# Altium schematic sheet Sheet2.SchDoc
size A3
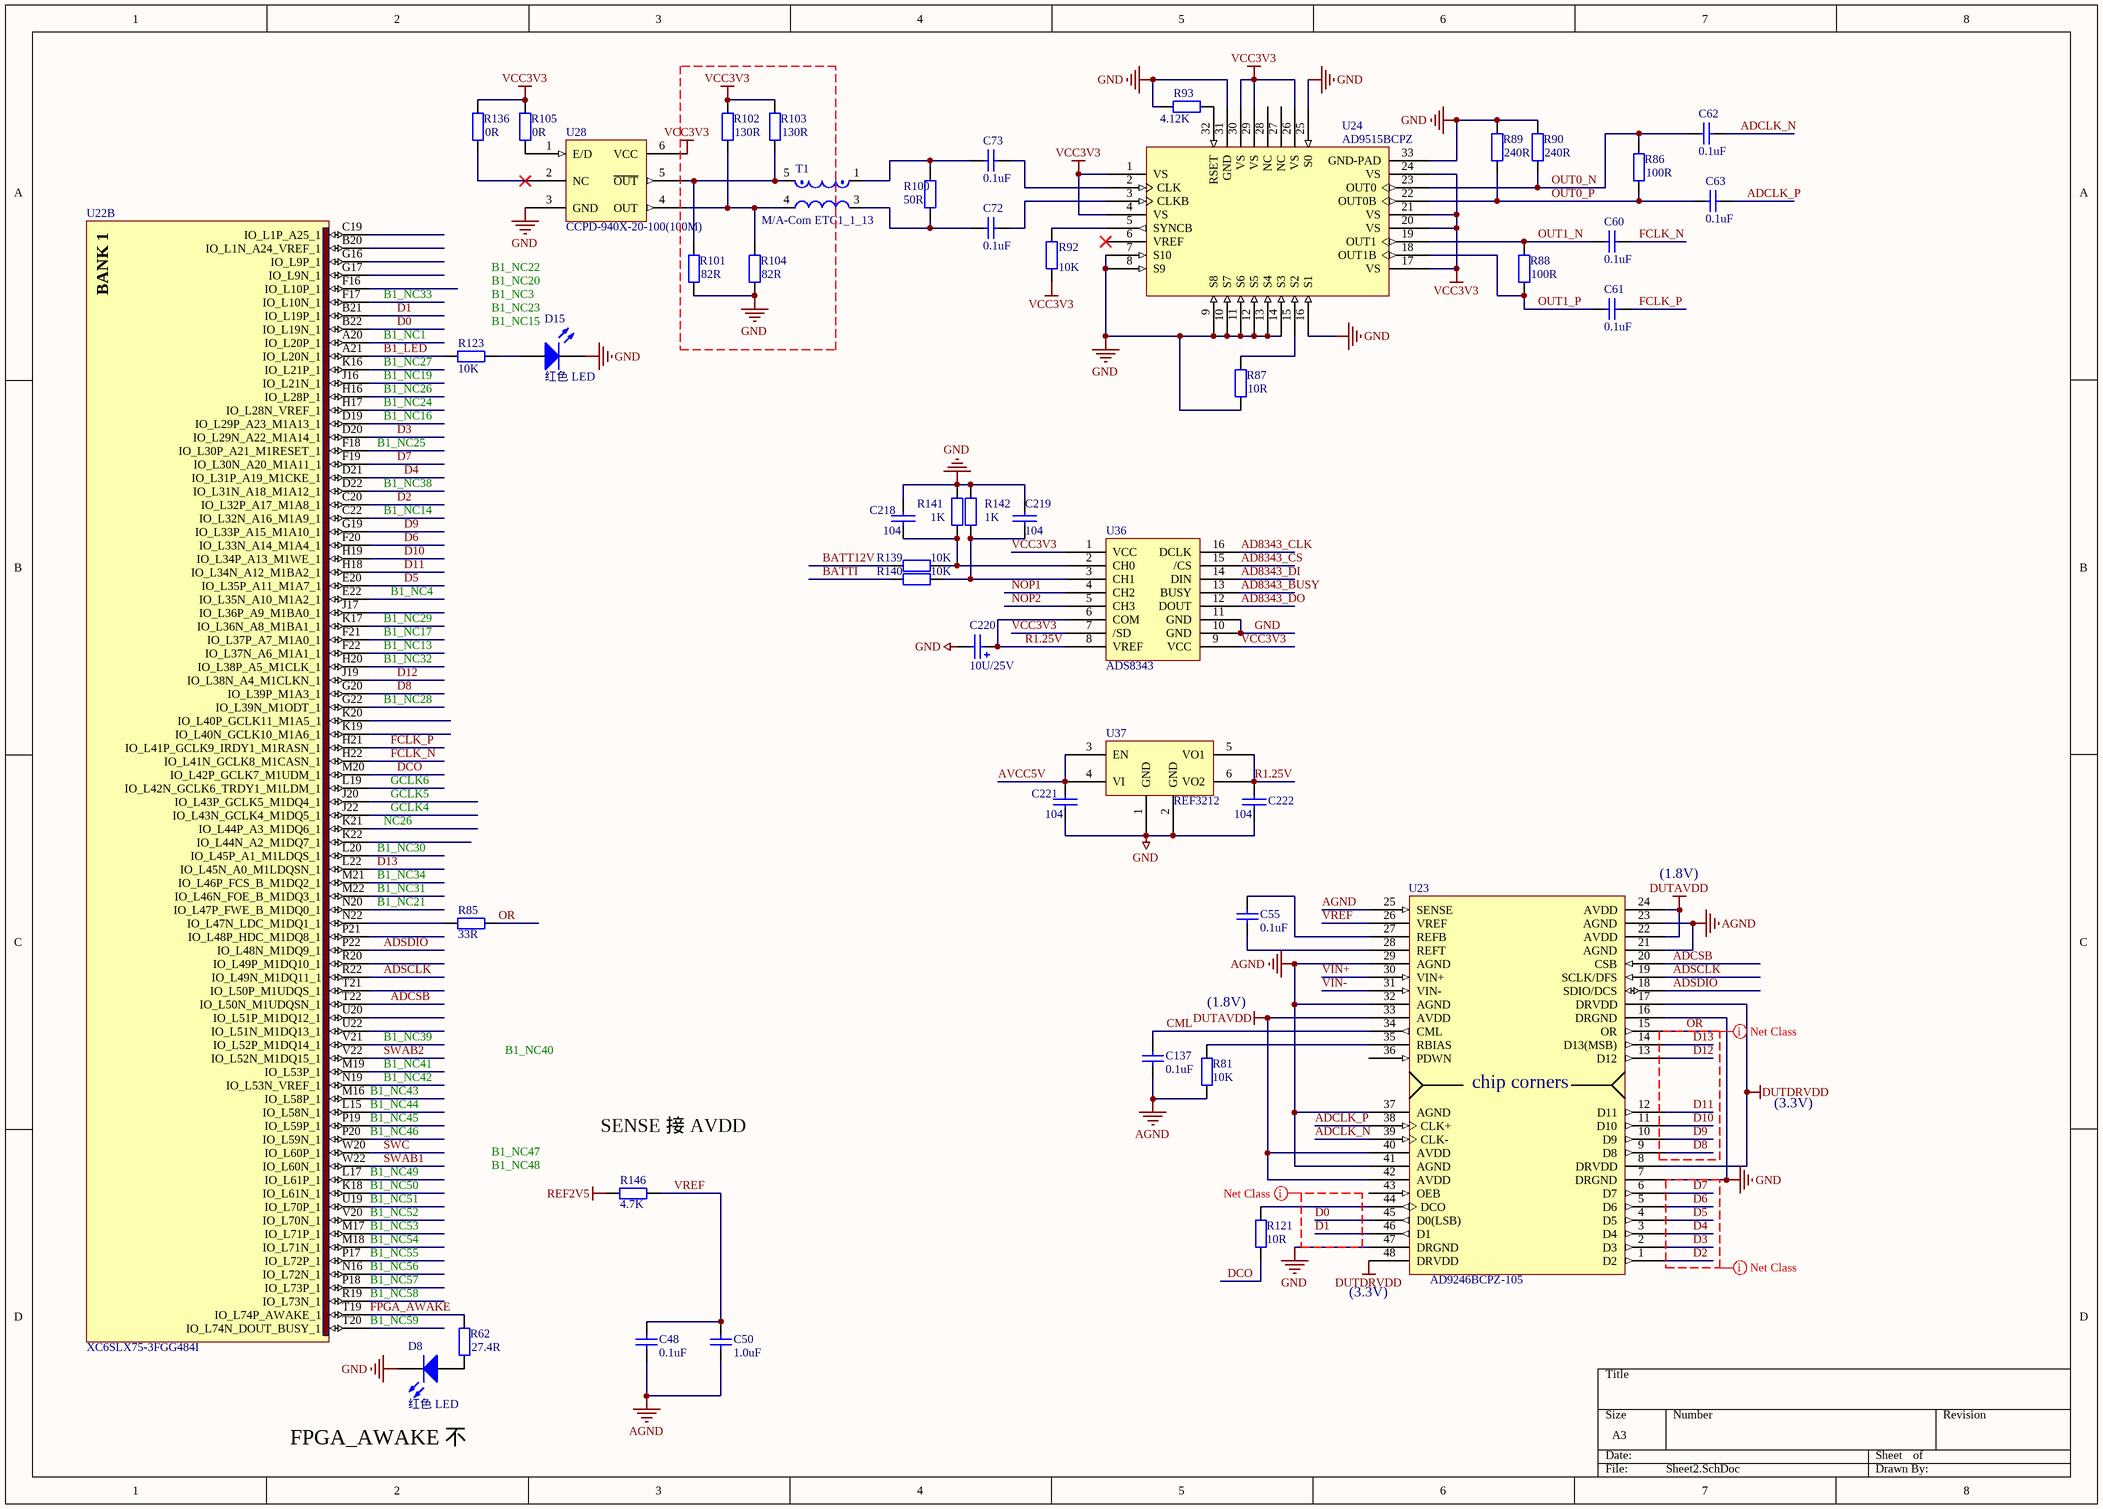
[diagram p0: Sheet2.SchDoc]

## Parts
C48  0.1uF  [0603C]
C50  1.0uF  [0805C]
C55  0.1uF  [0402C]
C60  0.1uF  [0402C]
C61  0.1uF  [0402C]
C62  0.1uF  [0402C]
C63  0.1uF  [0402C]
C72  0.1uF  [0402C]
C73  0.1uF  [0402C]
C137  0.1uF  [0603C]
C218  104  [0603X]
C219  104  [0603X]
C220  10U/25V  [CAP-B]
C221  104  [0603X]
C222  104  [0603X]
D8  红色 LED  [0805LED]
D15  红色 LED  [0805LED]
R62  27.4R  [0603R]
R81  10K  [0603R]
R85  33R  [0603R]
R86  100R  [0603R]
R87  10R  [0603R]
R88  100R  [0603R]
R89  240R  [0603R]
R90  240R  [0603R]
R92  10K  [0603R]
R93  4.12K  [0603R]
R100  50R  [0603R]
R101  82R  [0603R]
R102  130R  [0603R]
R103  130R  [0603R]
R104  82R  [0603R]
R105  0R  [0603R]
R121  10R  [0603R]
R123  10K  [0603R]
R136  0R  [0603R]
R139  10K  [0603R]
R140  10K  [0603R]
R141  1K  [0603R]
R142  1K  [0603R]
R146  4.7K  [0603R]
T1  M/A-Com ETC1_1_13  [SM-22]
U22  XC6SLX75-3FGG484I  [FGG484]  (part B of 8)
U23  AD9246BCPZ-105  [CP-48]
U24  AD9515BCPZ  [CP-32-1_5X5]
U28  CCPD-940X-20-100(100M)  [CCPD-940X-033]
U36  ADS8343  [SOP16X]
U37  REF3212  [SOT23-6]

## Nets
AGND: C48.2 C50.2 C137.1 R81.1 U23.21(AGND) U23.23(AGND) U23.25(SENSE) U23.29(AGND) U23.32(AGND) U23.37(AGND) U23.41(AGND)
DUTAVDD: U23.22(AVDD) U23.24(AVDD) U23.33(AVDD) U23.40(AVDD) U23.42(AVDD)
DUTDRVDD: U23.8(DRVDD) U23.17(DRVDD) U23.48(DRVDD)
GND: C218.1 C219.1 C220.2 C221.2 C222.2 D8.2(K) D15.2(K) R87.1 R89.2 R90.2 R93.2 R101.1 R104.1 R141.1 R142.1 U23.7(DRGND) U23.16(DRGND) U23.47(DRGND) U24.7(S10) U24.8(S9) U24.9(S8) U24.10(S7) U24.11(S6) U24.12(S5) U24.13(S4) U24.14(S3) U24.16(S1) U24.25(S0) U24.31(GND) U24.33(GND-PAD) U28.3(GND) U36.10(GND) U36.11(GND) U37.1(GND) U37.2(GND)
REF2V5: R146.1
VCC3V3: R92.1 R102.2 R103.2 R105.2 R136.2 U24.1(VS) U24.4(VS) U24.17(VS) U24.20(VS) U24.21(VS) U24.24(VS) U24.26(VS) U24.29(VS) U24.30(VS) U28.6(VCC) U36.1(VCC) U36.7(/SD) U36.9(VCC)
AD8343_BUSY: U36.13(BUSY)
AD8343_CLK: U36.16(DCLK)
AD8343_CS: U36.15(/CS)
AD8343_DI: U36.14(DIN)
AD8343_DO: U36.12(DOUT)
ADCLK_N: C62.1 U23.39(CLK-)
ADCLK_P: C63.1 U23.38(CLK+)
ADCSB: U22.T22(IO_L50N_M1UDQSN_1) U23.20(CSB)
ADSCLK: U22.R22(IO_L49N_M1DQ11_1) U23.19(SCLK/DFS)
ADSDIO: U22.P22(IO_L48N_M1DQ9_1) U23.18(SDIO/DCS)
AVCC5V: C221.1 U37.3(EN) U37.4(VI)
B1_LED: R123.1 U22.A21(IO_L20N_1)
B1_NC1: U22.A20(IO_L20P_1)
B1_NC4: U22.E22(IO_L35N_A10_M1A2_1)
B1_NC13: U22.F22(IO_L37N_A6_M1A1_1)
B1_NC14: U22.C22(IO_L32N_A16_M1A9_1)
B1_NC16: U22.D19(IO_L29P_A23_M1A13_1)
B1_NC17: U22.F21(IO_L37P_A7_M1A0_1)
B1_NC19: U22.J16(IO_L21N_1)
B1_NC21: U22.N20(IO_L47P_FWE_B_M1DQ0_1)
B1_NC24: U22.H17(IO_L28N_VREF_1)
B1_NC25: U22.F18(IO_L30P_A21_M1RESET_1)
B1_NC26: U22.H16(IO_L28P_1)
B1_NC27: U22.K16(IO_L21P_1)
B1_NC28: U22.G22(IO_L39N_M1ODT_1)
B1_NC29: U22.K17(IO_L36N_A8_M1BA1_1)
B1_NC30: U22.L20(IO_L45P_A1_M1LDQS_1)
B1_NC31: U22.M22(IO_L46N_FOE_B_M1DQ3_1)
B1_NC32: U22.H20(IO_L38P_A5_M1CLK_1)
B1_NC33: U22.F17(IO_L10N_1)
B1_NC34: U22.M21(IO_L46P_FCS_B_M1DQ2_1)
B1_NC38: U22.D22(IO_L31N_A18_M1A12_1)
B1_NC39: U22.V21(IO_L52P_M1DQ14_1)
B1_NC41: U22.M19(IO_L53P_1)
B1_NC42: U22.N19(IO_L53N_VREF_1)
B1_NC43: U22.M16(IO_L58P_1)
B1_NC44: U22.L15(IO_L58N_1)
B1_NC45: U22.P19(IO_L59P_1)
B1_NC46: U22.P20(IO_L59N_1)
B1_NC49: U22.L17(IO_L61P_1)
B1_NC50: U22.K18(IO_L61N_1)
B1_NC51: U22.U19(IO_L70P_1)
B1_NC52: U22.V20(IO_L70N_1)
B1_NC53: U22.M17(IO_L71P_1)
B1_NC54: U22.M18(IO_L71N_1)
B1_NC55: U22.P17(IO_L72P_1)
B1_NC56: U22.N16(IO_L72N_1)
B1_NC57: U22.P18(IO_L73P_1)
B1_NC58: U22.R19(IO_L73N_1)
B1_NC59: U22.T20(IO_L74N_DOUT_BUSY_1)
BATT12V: R139.2
BATTI: R140.2
CML: C137.2 U23.34(CML)
D0: U22.B22(IO_L19N_1) U23.45(D0(LSB))
D1: U22.B21(IO_L19P_1) U23.46(D1)
D2: U22.C20(IO_L32P_A17_M1A8_1) U23.1(D2)
D3: U22.D20(IO_L29N_A22_M1A14_1) U23.2(D3)
D4: U22.D21(IO_L31P_A19_M1CKE_1) U23.3(D4)
D5: U22.E20(IO_L35P_A11_M1A7_1) U23.4(D5)
D6: U22.F20(IO_L33N_A14_M1A4_1) U23.5(D6)
D7: U22.F19(IO_L30N_A20_M1A11_1) U23.6(D7)
D8: U22.G20(IO_L39P_M1A3_1) U23.9(D8)
D9: U22.G19(IO_L33P_A15_M1A10_1) U23.10(D9)
D10: U22.H19(IO_L34P_A13_M1WE_1) U23.11(D10)
D11: U22.H18(IO_L34N_A12_M1BA2_1) U23.12(D11)
D12: U22.J19(IO_L38N_A4_M1CLKN_1) U23.13(D12)
D13: U22.L22(IO_L45N_A0_M1LDQSN_1) U23.14(D13(MSB))
DCO: R121.1 U22.M20(IO_L42P_GCLK7_M1UDM_1)
FCLK_N: C60.1 U22.H22(IO_L41N_GCLK8_M1CASN_1)
FCLK_P: C61.1 U22.H21(IO_L41P_GCLK9_IRDY1_M1RASN_1)
FPGA_AWAKE: R62.2 U22.T19(IO_L74P_AWAKE_1)
GCLK4: U22.J22(IO_L43N_GCLK4_M1DQ5_1)
GCLK5: U22.J20(IO_L43P_GCLK5_M1DQ4_1)
GCLK6: U22.L19(IO_L42N_GCLK6_TRDY1_M1LDM_1)
NC26: U22.K21(IO_L44P_A3_M1DQ6_1)
NOP1: U36.4(CH2)
NOP2: U36.5(CH3)
OR: R85.1 U23.15(OR)
OUT0_N: C62.2 R86.2 R90.1 U24.23(OUT0)
OUT0_P: C63.2 R86.1 R89.1 U24.22(OUT0B)
OUT1_N: C60.2 R88.2 U24.19(OUT1)
OUT1_P: C61.2 R88.1 U24.18(OUT1B)
R1.25V: C220.1 C222.1 U36.6(COM) U36.8(VREF) U37.5(VO1) U37.6(VO2)
SWAB1: U22.W22(IO_L60N_1)
SWAB2: U22.V22(IO_L52N_M1DQ15_1)
SWC: U22.W20(IO_L60P_1)
VIN+: U23.30(VIN+)
VIN-: U23.31(VIN-)
VREF: C48.1 C50.1 R146.2 U23.26(VREF)
NetC55_1: C55.1 U23.28(REFT)
NetC55_2: C55.2 U23.27(REFB)
NetC72_1: C72.1 U24.3(CLKB)
NetC72_2: C72.2 R100.1 T1.3(SEC)
NetC73_1: C73.1 U24.2(CLK)
NetC73_2: C73.2 R100.2 T1.1(SEC_DOT)
NetC218_2: C218.2 R139.1 R141.2 U36.2(CH0)
NetC219_2: C219.2 R140.1 R142.2 U36.3(CH1)
NetD8_1: D8.1(A) R62.1
NetD15_1: D15.1(A) R123.2
NetR81_2: R81.2 U23.35(RBIAS)
NetR85_2: R85.2 U22.N22(IO_L47N_LDC_M1DQ1_1)
NetR87_2: R87.2 U24.15(S2)
NetR92_2: R92.2 U24.5(SYNCB)
NetR93_1: R93.1 U24.32(RSET)
NetR101_2: R101.2 R103.1 T1.5(PRI_DOT) U28.5(~{OUT})
NetR102_1: R102.1 R104.2 T1.4(PRI) U28.4(OUT)
NetR105_1: R105.1 U28.1(E/D)
NetR121_2: R121.2 U23.44(DCO)
NetR136_1: R136.1 U28.2(NC)

Not connected (* = marked no-connect by the designer): U22 B20(IO_L1N_A24_VREF_1) C19(IO_L1P_A25_1) F16(IO_L10P_1) G16(IO_L9P_1) G17(IO_L9N_1) J17(IO_L36P_A9_M1BA0_1) K19(IO_L40N_GCLK10_M1A6_1) K20(IO_L40P_GCLK11_M1A5_1) K22(IO_L44N_A2_M1DQ7_1) P21(IO_L48P_HDC_M1DQ8_1) R20(IO_L49P_M1DQ10_1) T21(IO_L50P_M1UDQS_1) U20(IO_L51P_M1DQ12_1) U22(IO_L51N_M1DQ13_1); U23 36(PDWN) 43(OEB); U24 6(VREF)* 27(NC) 28(NC)

## Layout directives
net class AD: D0, D1, D2, D3, D4, D5, D6, D7, D8, D9, D10, D11, D12, D13, OR

## Notes on the sheet
- (near U23) (1.8V)
- (1.8V)
- (3.3V)
- (near R146) SENSE 接 AVDD
- (near U23) (3.3V)
- FPGA_AWAKE 不
- Labels drawn without touching a wire or pin: B1_NC3, B1_NC15, B1_NC20, B1_NC22, B1_NC23, B1_NC40, B1_NC47, B1_NC48
- (in symbol AD9246) chip corners
- (in symbol XC6SLX45-L1FGG484I, part B) BANK 1

## Library data of the parts
C48 C50 C55 C60-C63 C72 C73 C137 = Cap: Capacitor; Published: 8-Jun-2000; LatestRevisionDate: 17-Jul-2002; LatestRevisionNote: Re-released for DXP Platform.; PackageReference: RAD-0.3; Publisher: Altium Limited
  C48 C55 C60-C63 C72 C73 C137: Value: 0.1uF
  C50: Value: 1.0uF
C218 C219 C221 C222 = 2543.S01_104_49
C220 = CAP+
D8 D15 = LED0: Typical INFRARED GaAs LED; Published: 8-Jun-2000; LatestRevisionDate: 08-Jul-2005; LatestRevisionNote: Mech Layer 1 removed.; PackageReference: LED-0; Publisher: Altium Limited
R62 = Res2: Resistor; Value: 27.4; Published: 8-Jun-2000; LatestRevisionDate: 17-Jul-2002; LatestRevisionNote: Re-released for DXP Platform.; PackageReference: AXIAL-0.4; Publisher: Altium Limited
R81 R85 R86 R88-R90 R92 R93 R100 R123 R139 R140 R146 = Res2: Resistor; Published: 8-Jun-2000; LatestRevisionDate: 17-Jul-2002; LatestRevisionNote: Re-released for DXP Platform.; PackageReference: AXIAL-0.4; Publisher: Altium Limited
  R81 R92 R123 R139 R140: Value: 10K
  R85: Value: 33R
  R86 R88: Value: 100R
  R89 R90: Value: 240R
  R93: Value: 4.12K
  R100: Value: 50R
  R146: Value: 4.7K
R87 R101-R105 R136 = Res2: Resistor; Value: 100R; Published: 8-Jun-2000; LatestRevisionDate: 17-Jul-2002; LatestRevisionNote: Re-released for DXP Platform.; PackageReference: AXIAL-0.4; Publisher: Altium Limited
R121 R141 R142 = Res2: Resistor; Value: 10K; Published: 8-Jun-2000; LatestRevisionDate: 17-Jul-2002; LatestRevisionNote: Re-released for DXP Platform.; PackageReference: AXIAL-0.4; Publisher: Altium Limited
T1 = ETC1_1_13
U22 = XC6SLX45-L1FGG484I: Spartan-6 LX 1.0V FPGA, 316 User I/Os, 484-Ball Fine-Pitch BGA (1.0mm Pitch), Low Power Version, Industrial Grade, Pb-Free; FirstPublished: 17-Nov-2009; DatasheetVersion: ver1.3, Nov-2009; PackageVersion: ver1.1, Dec-2008; PackageReference: FGG484; Publisher: Altium Limited; PackageDescription: 484-Ball Fine Pitch Ball Grid Array 1.00 mm Pitch (FGG484) - Pb-Free; Code_JEDEC: MS-034-AAJ-1; Code_IPC: BGA100P22X22-484; ComponentLink1Description: Spartan-6 Datasheet; ComponentLink1URL: http://www.xilinx.com/support/documentation/data_sheets/ds160.pdf; ComponentLink2Description: Pinout Specification; ComponentLink2URL: http://www.xilinx.com/support/documentation/user_guides/ug385.pdf; ComponentLink3Description: FGG484 Package Drawing; ComponentLink3URL: http://www.xilinx.com/support/documentation/package_specs/fg484.pdf; ComponentLink4Description: Spartan-6 Documents; ComponentLink4URL: http://www.xilinx.com/support/documentation/spartan-6.htm; ComponentLink5Description: Xilinx.com Home; ComponentLink5URL: http://www.xilinx.com
U23 = AD9246
U24 = AD9515
U28 = OSC LVPECL